# EAGLE schematic Motorboard (EAGLE 7.2.0)
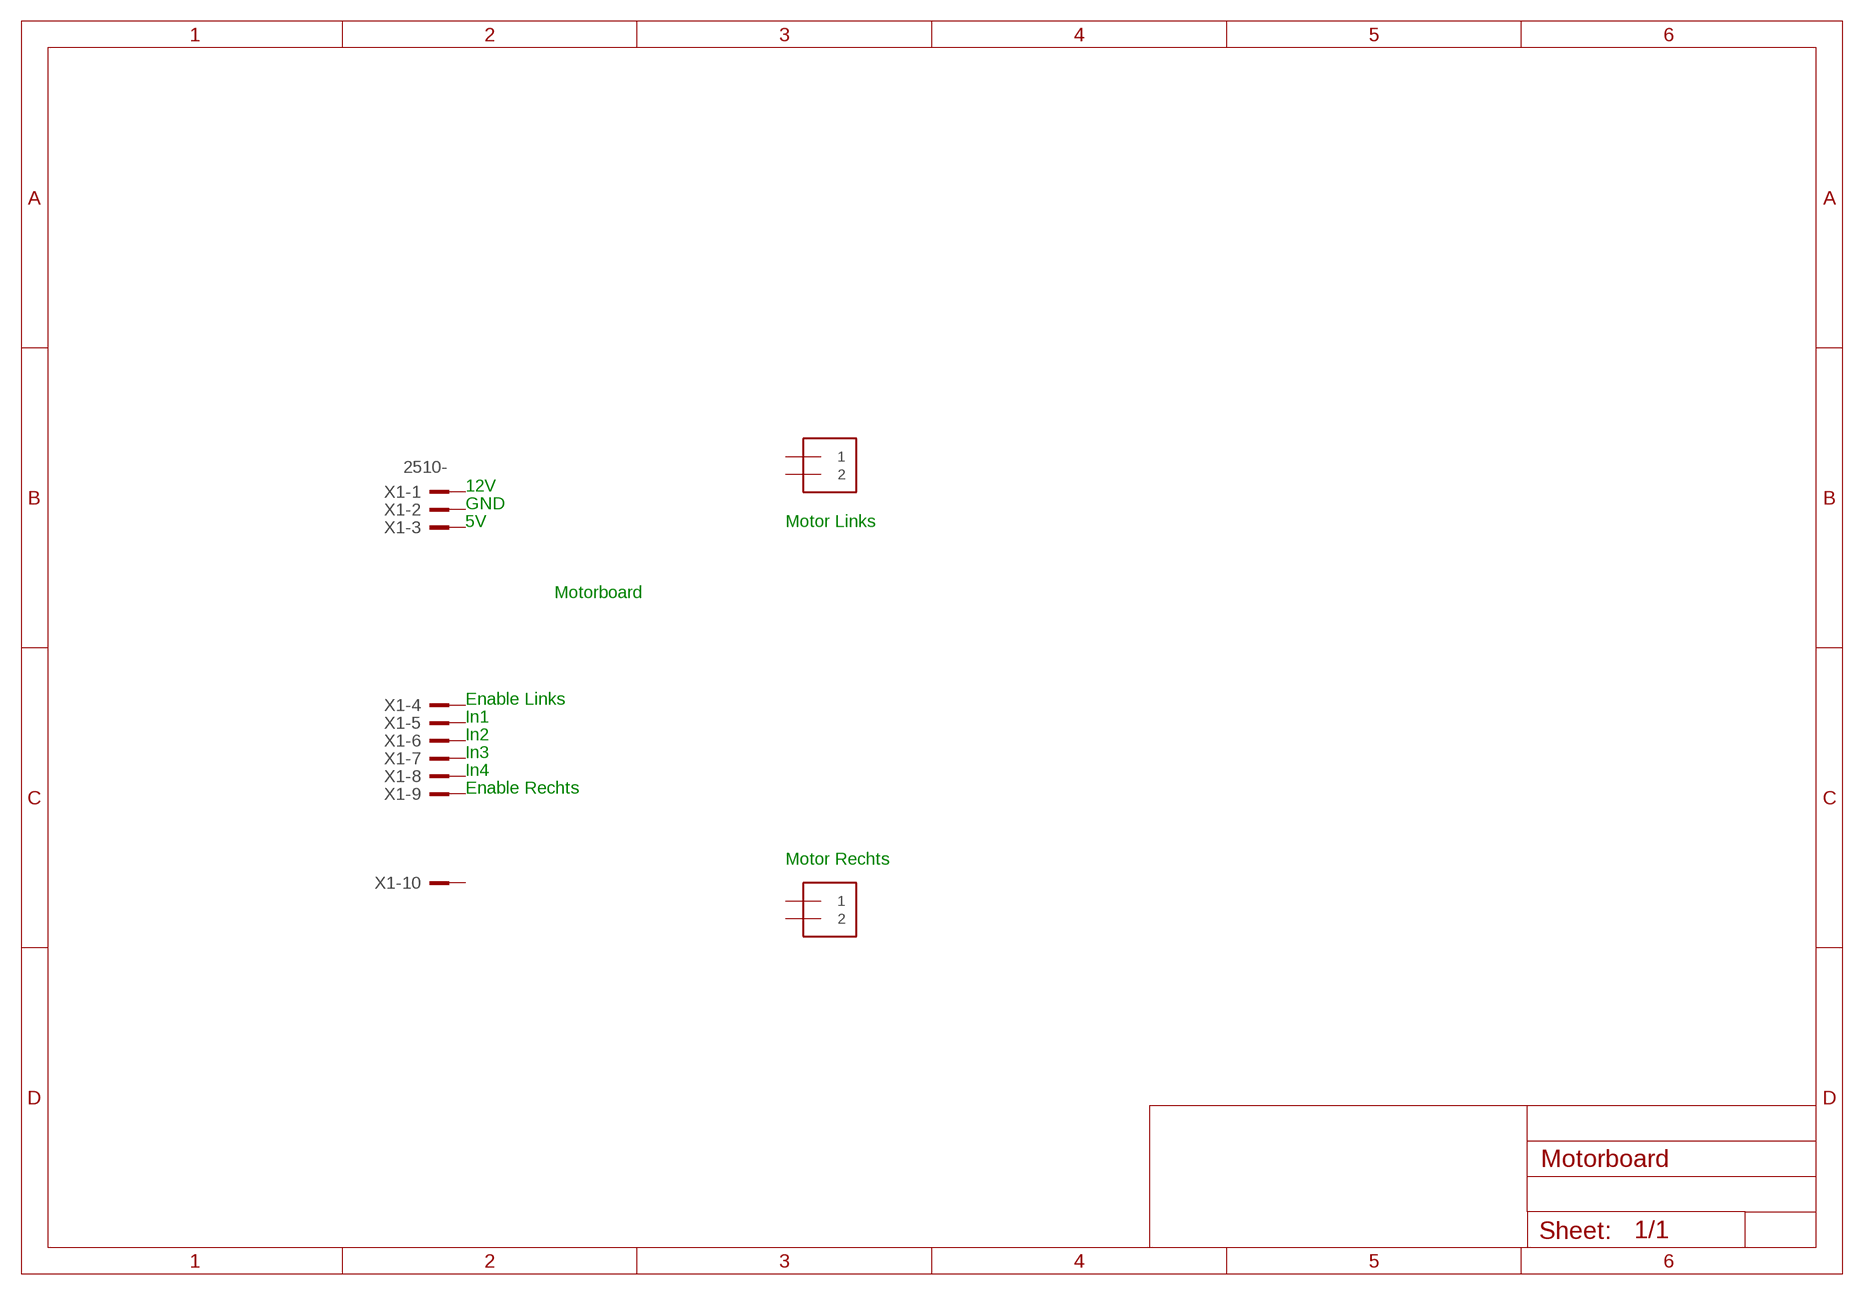
[diagram p0: schematic, sheet 1]

## Parts
J1  1X2-3.5MM  [1X2-3.5MM]
J2  1X2-3.5MM  [1X2-3.5MM]
X1  2510-  [PAK100/2500-10]
Unconnected: J1.1 J1.2 J2.1 J2.2 X1.1 X1.2 X1.3 X1.4 X1.5 X1.6 X1.7 X1.8 X1.9 X1.10

## Notes on the sheet
- 12V
- GND
- 5V | Motor Links
- Motorboard
- Enable Links
- In1
- In2
- In3
- In4
- Enable Rechts
- Motor Rechts

## Library data of the parts
J1 J2 = adafruit:1X2: 3.5mm Terminal block http://www.ladyada.net/library/pcb/eaglelibrary.html
X1 = con-3m:2510-: 3M (TM) Pak 100 4-Wall Header Source: 3M; MF: 3M; MPN: 2510-6002UB; OC_FARNELL: 9838244; OC_NEWARK: 46F4725